# Altium schematic sheet MCU.SchDoc
size A; SheetNumber: 6; SheetTotal: 6
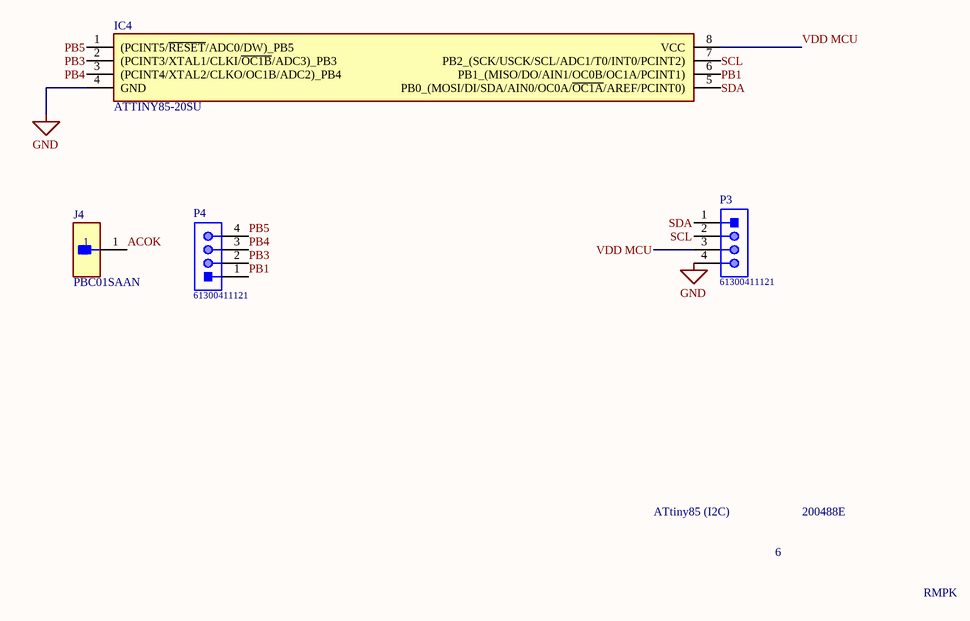
[diagram p0: MCU.SchDoc]

## Parts
IC4  ATTINY85-20SU  [SOIC127P798X216-8N]
J4  PBC01SAAN  [FP-PBC01SAAN-MFG]
P3  61300411121  [61300411121]
P4  61300411121  [61300411121]

## Nets
GND: IC4.4(GND) P3.4
ACOK: J4.1
PB1: IC4.6(PB1_(MISO/DO/AIN1/OC0B/OC1A/PCINT1)) P4.1
PB3: IC4.2((PCINT3/XTAL1/CLKI/~{OC1B}/ADC3)_PB3) P4.2
PB4: IC4.3((PCINT4/XTAL2/CLKO/OC1B/ADC2)_PB4) P4.3
PB5: IC4.1((PCINT5/~{RESET}/ADC0/DW)_PB5) P4.4
SCL: IC4.7(PB2_(SCK/USCK/SCL/ADC1/T0/INT0/PCINT2)) P3.2
SDA: IC4.5(PB0_(MOSI/DI/SDA/AIN0/OC0A/~{OC1A}/AREF/PCINT0)) P3.1
VDD MCU: IC4.8(VCC) P3.3

## Notes on the sheet
- ATtiny85 (I2C)
- 200488E
- 6
- RMPK

## Library data of the parts
IC4 = ATTINY85-20SU: Integrated Circuit; Manufacturer_Name: Microchip; Datasheet Link: https://componentsearchengine.com/Datasheets/2/ATTINY85-20SU.pdf; Height: 2.16mm; Manufacturer_Part_Number: ATTINY85-20SU; Mouser Part Number: 556-ATTINY85-20SU; Mouser Price/Stock: https://www.mouser.co.uk/ProductDetail/Microchip-Technology-Atmel/ATTINY85-20SU?qs=8jWQYweyg6N%2FGXnwAe4Icw%3D%3D; Arrow Part Number: ATTINY85-20SU; Arrow Price/Stock: https://www.arrow.com/en/products/attiny85-20su/microchip-technology?region=nac
J4 = CMP-25680-000032-1: CONN HEADER VERT 1POS; Number of Positions: 1; Connector Type: Male Pin; Gender: Male; Pitch: 2.54mm; Contact Material: Bronze; Mount: Through Hole; Length: 2.54mm; Height: 2.54mm; Lead Free: Lead Free; Number of Rows: 1; Contact Plating: Gold; Number of Contacts: 1; Housing Material: Plastic; Termination: Solder; Package Quantity: 1; Packaging: Bulk; Color: Black; Contact Mating Length: 0.23inch; Housing Color: Black; Width: 2.54mm
P3 P4 = CMP-1502-01064-1: THT Vertical Pin Header WR-PHD, Pitch 2.54 mm, Single Row, 4 pins; Manufacturer: Wurth Elektronik; Withstanding Voltage: 500VAC; Rated Current: 3A; Working Voltage: 250VAC; Pin Number: 4; Gender: Male; Contact Resistance: 20mOhm; Pitch: 2.54mm; Manufacturer URL: http://www.we-online.de; Operating Temperature: -40to105degC; Packaging: Bag; Mounting Technology: THT; Package Reference: 61300411121; Datasheet URL: https://katalog.we-online.de/em/datasheet/6130xx11121.pdf; Publisher: WurthElektronik; Part Number: 61300411121; Row Number: Single; Orientation: Vertical